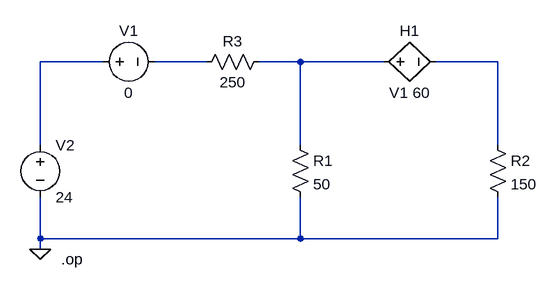
[diagram p0: schematic Draft2.asc]
Draft2.asc, the LTspice schematic file:
Version 4
SHEET 1 880 680
WIRE 0 192 -96 192
WIRE 160 192 80 192
WIRE 304 192 240 192
WIRE 432 192 304 192
WIRE 608 192 512 192
WIRE -96 320 -96 192
WIRE 304 320 304 192
WIRE 608 320 608 192
WIRE -96 464 -96 400
WIRE 304 464 304 400
WIRE 304 464 -96 464
WIRE 608 464 608 400
WIRE 608 464 304 464
WIRE -96 480 -96 464
FLAG -96 480 0
SYMBOL res 288 304 R0
SYMATTR InstName R1
SYMATTR Value 50
SYMBOL res 592 304 R0
SYMATTR InstName R2
SYMATTR Value 150
SYMBOL res 256 176 R90
WINDOW 0 0 56 VBottom 2
WINDOW 3 32 56 VTop 2
SYMATTR InstName R3
SYMATTR Value 250
SYMBOL voltage -16 192 R270
WINDOW 0 32 56 VTop 2
WINDOW 3 -32 56 VBottom 2
SYMATTR InstName V1
SYMATTR Value 0
SYMBOL voltage -96 304 R0
SYMATTR InstName V2
SYMATTR Value 24
SYMBOL h 416 192 R270
WINDOW 0 32 56 VTop 2
WINDOW 3 -32 56 VBottom 2
SYMATTR InstName H1
SYMATTR Value V1 60
TEXT -64 496 Left 2 !.op

The netlist it stands for:
* Draft2.asc
R1 N003 0 50
R2 N004 0 150
R3 N003 N002 250
V1 N001 N002 0
V2 N001 0 24
H1 N003 N004 V1 60
.op
.backanno
.end